# Altium schematic sheet Affi.SchDoc
size A4
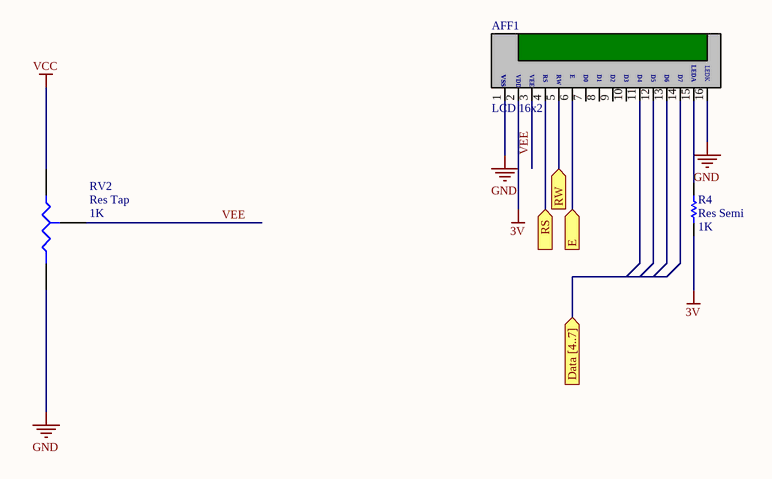
[diagram p0: Affi.SchDoc]

## Parts
AFF1  LCD 16x2  [LCRU01602DSFAWH]
R4  Res Semi  value 1K  [AXIAL-0.5]
RV2  Res Tap  value 1K  [VR3]

## Ports
Data [4..7] (in), E (in), RS (in), RW (in)

## Nets
3V: R4.1
GND: RV2.2(B)
VCC: RV2.1(A)
VEE: RV2.3(TAP)

Not connected (* = marked no-connect by the designer): R4 2

## Notes on the sheet
- (in symbol LCD 16x2) vss; VDD; VEE; RS; RW; E; D0; D1; D2; D3; D4; D5; D6; D7; LEDA; LEDK; 1; 2; 3; 4; 5; 6; 7; 8; 9; 10; 11; 12; 13; 14; 15; 16

## Library data of the parts
R4 = Res Semi: Semiconductor Resistor; Published: 8-Jun-2000; LatestRevisionDate: 17-Jul-2002; LatestRevisionNote: Re-released for DXP Platform.; PackageReference: AXIAL-0.5; Publisher: Altium Limited; PackageDescription: Axial Device, Thru-Hole; 2 Leads; 0.5 in Pin Spacing
RV2 = Res Tap: Tapped Resistor; Sim Note: Enter the Resistance value and the set point into parameter fields.; Set Position: 0.5; Published: 24-Mar-1999; LatestRevisionDate: 17-Jul-2002; LatestRevisionNote: Re-released for DXP Platform.; PackageReference: VR3; Publisher: Altium Limited; PackageDescription: Variable Resistor, Thru-Hole; 3 Leads